# Altium project DA1470x-SmartWatch.PrjPcb
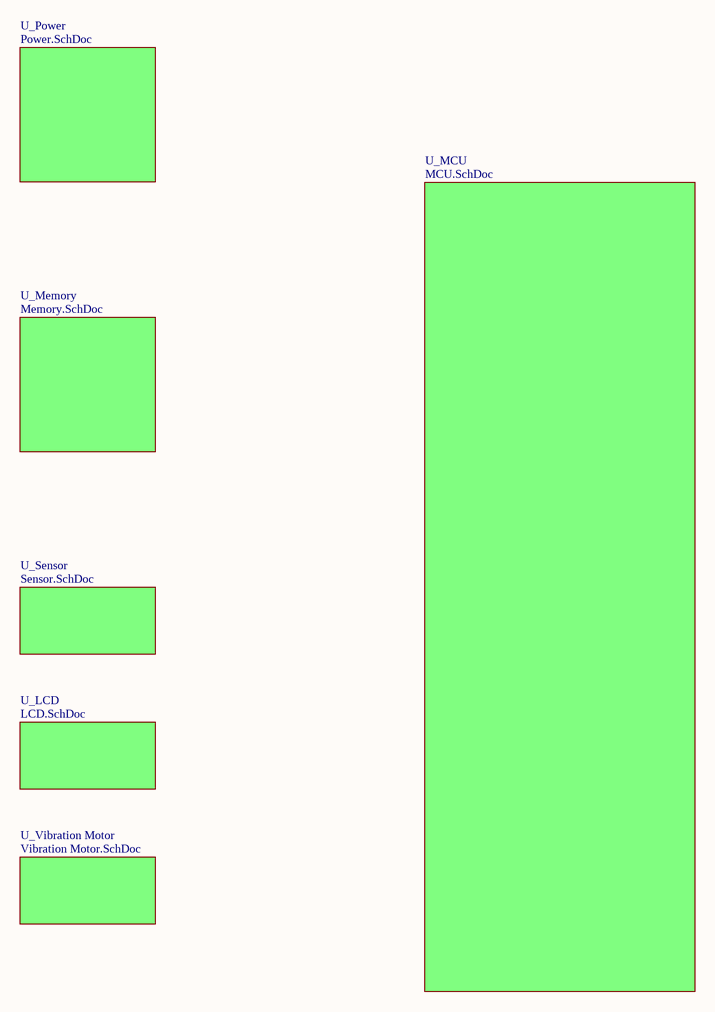
[diagram p0: DA1470x-SmartWatch.SchDoc]
7 sheets, 28 parts. Net scope: flat (ports and power ports of the same name join across sheets).
Sheets:
  DA1470x-SmartWatch.SchDoc
    U_Power = Power.SchDoc
    U_Memory = Memory.SchDoc
    U_MCU = MCU.SchDoc
    U_Sensor = Sensor.SchDoc
    U_LCD = LCD.SchDoc
    U_Vibration Motor = Vibration Motor.SchDoc

## Sheet DA1470x-SmartWatch.SchDoc: DA1470x-SmartWatch
size A3; Organization: Altium Limited; Address1: L3, 12a Rodborough Rd; Address2: Frenchs Forest; Address3: NSW; Address4: Australia 2086; SheetNumber: 1; SheetTotal: 7; SheetSize: A3

### Sub-sheets
U_LCD = LCD.SchDoc: no entries
U_MCU = MCU.SchDoc: no entries
U_Memory = Memory.SchDoc: no entries
U_Power = Power.SchDoc: no entries
U_Sensor = Sensor.SchDoc: no entries
U_Vibration Motor = Vibration Motor.SchDoc: no entries

### Notes on the sheet
- Title:
- Size:
- Project:
- Revision:
- Sheet
- of
- Date:
- YıLDıZ IoT
- Elperek Mahallesi
- Saray Sokak, No:12
- SAKARYA / TURKEY
- File:

## Sheet Power.SchDoc
size A4; ApprovedBy: Muhammet YILDIZ; CheckedBy: Muhammet YILDIZ; Author: Muhammet YILDIZ; CompanyName: YıLDıZ IoT; DrawnBy: Muhammet YILDIZ; Engineer: Muhammet YILDIZ; Organization: YıLDıZ IoT; Address1: Elperek Mahallesi; Address2: Saray Sokak No:12; Address3: SAKARYA / TURKEY; Revision: 1; SheetNumber: 2; SheetTotal: 2; SheetSize: A4

### Notes on the sheet
- Title:
- Size:
- Project:
- Revision:
- Sheet
- of
- Date:
- YıLDıZ IoT
- Elperek Mahallesi
- Saray Sokak, No:12
- SAKARYA / TURKEY
- File:

## Sheet Memory.SchDoc: Memory
size A4; ApprovedBy: Muhammet YILDIZ; CheckedBy: Muhammet YILDIZ; Author: Muhammet YILDIZ; CompanyName: YıLDıZ IoT; DrawnBy: Muhammet YILDIZ; Engineer: Muhammet YILDIZ; Organization: YıLDıZ IoT; Address1: Elperek Mahallesi; Address2: Saray Sokak No:12; Address3: SAKARYA / TURKEY; Revision: 1; SheetNumber: 4; SheetTotal: 4; SheetSize: A4
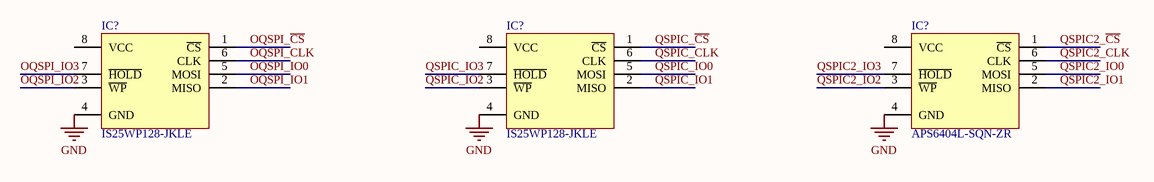
[diagram p1: Memory.SchDoc]

### Parts
(Parts that share a designator on the sheet are numbered #1, #2 ... from top to bottom, then left to right.)
IC?#1  IS25WP128-JKLE  [WINBOND WSON-8 6x5mm]
IC?#2  IS25WP128-JKLE  [WINBOND WSON-8 6x5mm]
IC?#3  APS6404L-SQN-ZR  [WINBOND WSON-8 6x5mm]

### Nets
GND: IC?#1.4(GND) IC?#2.4(GND) IC?#3.4(GND)
OQSPI_~{CS}: IC?#1.1(~{CS})
OQSPI_CLK: IC?#1.6(CLK)
OQSPI_IO0: IC?#1.5(MOSI)
OQSPI_IO1: IC?#1.2(MISO)
OQSPI_IO2: IC?#1.3(~{WP})
OQSPI_IO3: IC?#1.7(~{HOLD})
QSPIC2_~{CS}: IC?#3.1(~{CS})
QSPIC2_CLK: IC?#3.6(CLK)
QSPIC2_IO0: IC?#3.5(MOSI)
QSPIC2_IO1: IC?#3.2(MISO)
QSPIC2_IO2: IC?#3.3(~{WP})
QSPIC2_IO3: IC?#3.7(~{HOLD})
QSPIC_~{CS}: IC?#2.1(~{CS})
QSPIC_CLK: IC?#2.6(CLK)
QSPIC_IO0: IC?#2.5(MOSI)
QSPIC_IO1: IC?#2.2(MISO)
QSPIC_IO2: IC?#2.3(~{WP})
QSPIC_IO3: IC?#2.7(~{HOLD})

Not connected (* = marked no-connect by the designer): IC?#1 8(VCC); IC?#2 8(VCC); IC?#3 8(VCC)

### Notes on the sheet
- Title:
- Size:
- Project:
- Revision:
- Sheet
- of
- Date:
- YıLDıZ IoT
- Elperek Mahallesi
- Saray Sokak, No:12
- SAKARYA / TURKEY
- File:

### Library data of the parts
IC?#1 IC?#2 = WINBOND FLASH SPI 8PIN: NOR Flash Serial (SPI, Dual SPI, Quad SPI) 1.8V 128M-bit 16M x 8 8ns 8-Pin WSON EP; Manufacturer: ISSI; Density: 128Mb; Address Bus Width: 24b; Interface: SPI,Serial; Page Size: 256B; Supplier: Digi-Key; Supplier Part Number: 706-1624-ND; Manufacturer Part Number: IS25WP128-JKLE; RoHS: Yes; Category: Memory; Stock: 1395; Pricing: 1=2.11, 10=1.922, 25=1.8704, 40=1.86075, 80=1.66325, 230=1.65848, 570=1.63344, 1140=1.5641, 5130=1.45623 (USD); Pins: 8; Min Operating Temperature: -40°C; Max Operating Temperature: 105°C; Memory Format: NOR; Operating Supply Voltage: 1.8V; RoHS Compliant: Yes; ComponentLink1URL: http://www.mouser.com/ds/2/198/IS25WP032-064-128-737458.pdf?src-supplier=Mouser; ComponentLink1Description: http://www.mouser.com/ds/2/198/IS25WP032-064-128-737458.pdf?src-supplier=Mouser; ComponentLink2URL: http://www.issi.com/WW/pdf/IS25WP032-064-128.pdf?src-supplier=Avnet; ComponentLink2Description: http://www.issi.com/WW/pdf/IS25WP032-064-128.pdf?src-supplier=Avnet; ComponentLink3URL: http://www.issi.com/WW/pdf/25WP128.pdf?src-supplier=Digi-Key; ComponentLink3Description: http://www.issi.com/WW/pdf/25WP128.pdf?src-supplier=Digi-Key
IC?#3 = WINBOND FLASH SPI 8PIN: NOR Flash Serial (SPI, Dual SPI, Quad SPI) 1.8V 128M-bit 16M x 8 8ns 8-Pin WSON EP; Manufacturer: AP Memory; Supplier: Mouser; Supplier Part Number: 878-APS6404L-SQN-ZR; Manufacturer Part Number: APS6404L-SQN-ZR; RoHS: No; Stock: 4950; Pricing: 1=1.59, 10=1.46, 50=1.46, 100=1.26, 1000=1.19, 10000=0.985 (USD)

## Sheet MCU.SchDoc
size A3; Organization: Altium Limited; Address1: L3, 12a Rodborough Rd; Address2: Frenchs Forest; Address3: NSW; Address4: Australia 2086; SheetNumber: 3; SheetTotal: 7; SheetSize: A3
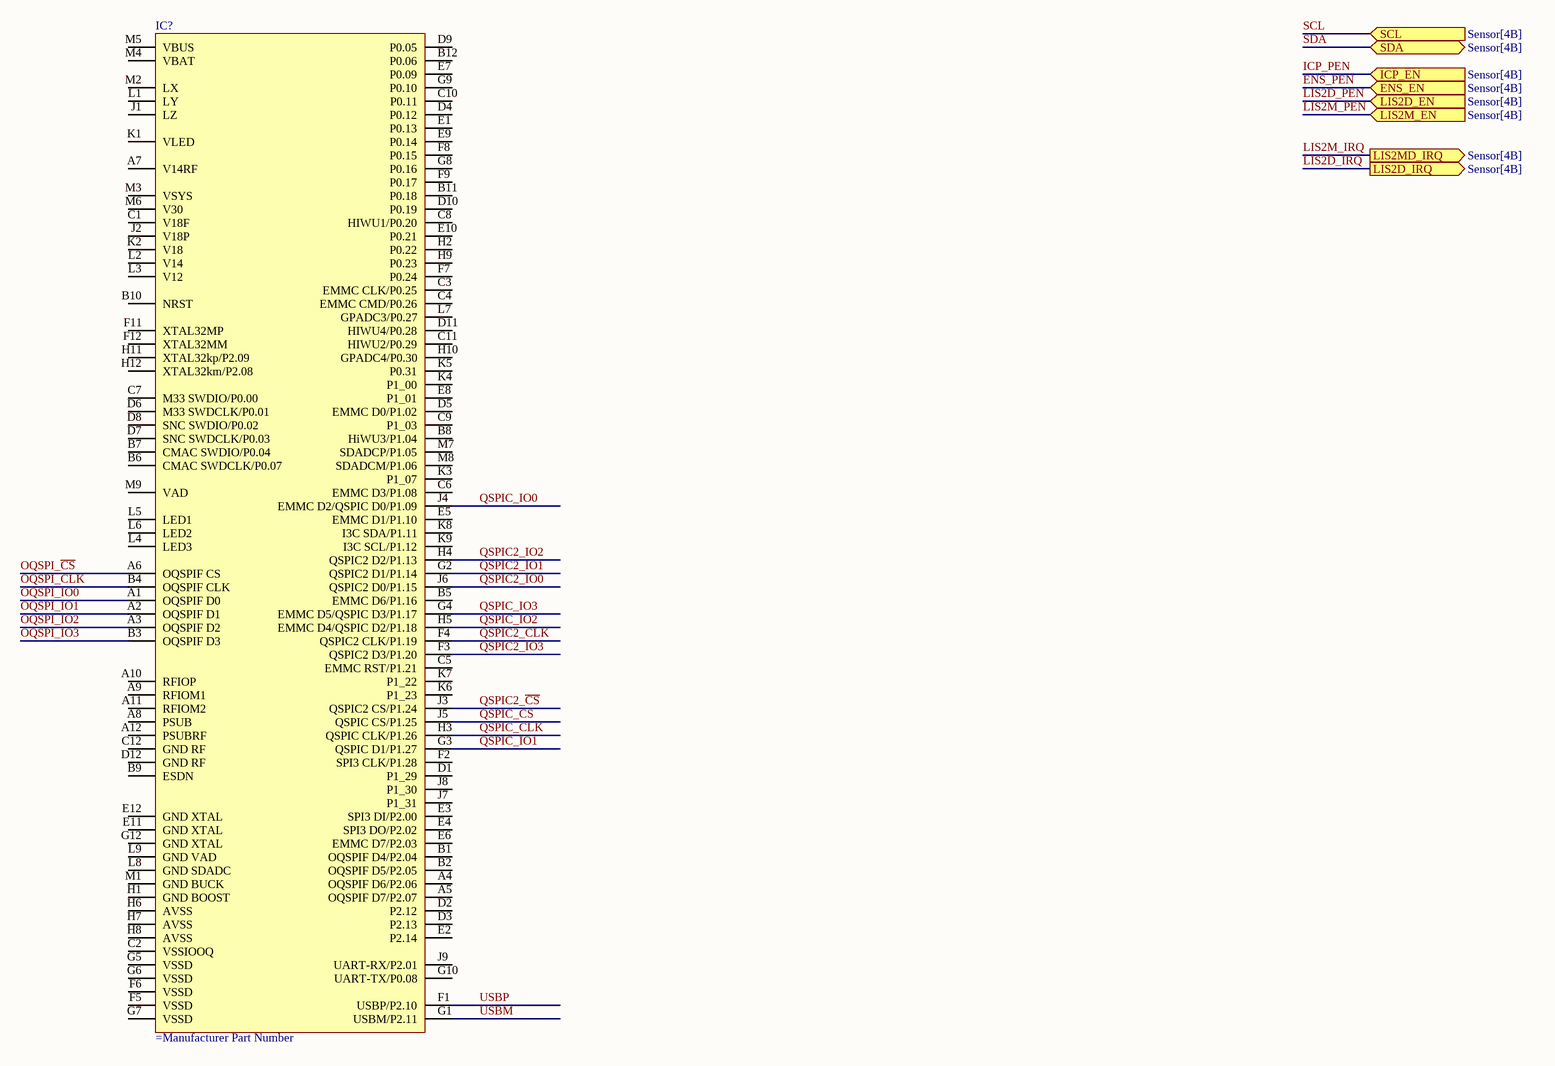
[diagram p2: MCU.SchDoc]

### Parts
(Parts that share a designator on the sheet are numbered #1, #2 ... from top to bottom, then left to right.)
IC?#4  (no value)  [DIALOG VFBGA142]

### Ports
ENS_EN (in, see Sensor[4B]), ICP_EN (in, see Sensor[4B]), LIS2D_EN (in, see Sensor[4B]), LIS2D_IRQ (out, see Sensor[4B]), LIS2M_EN (in, see Sensor[4B]), LIS2MD_IRQ (out, see Sensor[4B]), SCL (in, see Sensor[4B]), SDA (bidir, see Sensor[4B])

### Nets
OQSPI_~{CS}: IC?#4.A6(OQSPIF_CS)
OQSPI_CLK: IC?#4.B4(OQSPIF_CLK)
OQSPI_IO0: IC?#4.A1(OQSPIF_D0)
OQSPI_IO1: IC?#4.A2(OQSPIF_D1)
OQSPI_IO2: IC?#4.A3(OQSPIF_D2)
OQSPI_IO3: IC?#4.B3(OQSPIF_D3)
QSPIC2_~{CS}: IC?#4.J3(QSPIC2_CS/P1.24)
QSPIC2_CLK: IC?#4.F4(QSPIC2_CLK/P1.19)
QSPIC2_IO0: IC?#4.J6(QSPIC2_D0/P1.15)
QSPIC2_IO1: IC?#4.G2(QSPIC2_D1/P1.14)
QSPIC2_IO2: IC?#4.H4(QSPIC2_D2/P1.13)
QSPIC2_IO3: IC?#4.F3(QSPIC2_D3/P1.20)
QSPIC_~{CS}: IC?#4.J5(QSPIC_CS/P1.25)
QSPIC_CLK: IC?#4.H3(QSPIC_CLK/P1.26)
QSPIC_IO0: IC?#4.J4(EMMC_D2/QSPIC_D0/P1.09)
QSPIC_IO1: IC?#4.G3(QSPIC_D1/P1.27)
QSPIC_IO2: IC?#4.H5(EMMC_D4/QSPIC_D2/P1.18)
QSPIC_IO3: IC?#4.G4(EMMC_D5/QSPIC_D3/P1.17)
USBM: IC?#4.G1(USBM/P2.11)
USBP: IC?#4.F1(USBP/P2.10)

Not connected (* = marked no-connect by the designer): IC?#4 A4(OQSPIF_D6/P2.06) A5(OQSPIF_D7/P2.07) A7(V14RF) A8(PSUB) A9(RFIOM1) A10(RFIOP) A11(RFIOM2) A12(PSUBRF) B1(OQSPIF_D4/P2.04) B2(OQSPIF_D5/P2.05) B5(EMMC_D6/P1.16) B6(CMAC_SWDCLK/P0.07) B7(CMAC_SWDIO/P0.04) B8(HiWU3/P1.04) B9(ESDN) B10(NRST) B11(P0.18) B12(P0.06) C1(V18F) C2(VSSIOOQ) C3(EMMC_CLK/P0.25) C4(EMMC_CMD/P0.26) C5(EMMC_RST/P1.21) C6(EMMC_D3/P1.08) C7(M33_SWDIO/P0.00) C8(HIWU1/P0.20) C9(P1_03) C10(P0.11) C11(HIWU2/P0.29) C12(GND_RF) D1(P1_29) D2(P2.12) D3(P2.13) D4(P0.12) D5(EMMC_D0/P1.02) D6(M33_SWDCLK/P0.01) D7(SNC_SWDCLK/P0.03) D8(SNC_SWDIO/P0.02) D9(P0.05) D10(P0.19) D11(HIWU4/P0.28) D12(GND_RF) E1(P0.13) E2(P2.14) E3(SPI3_DI/P2.00) E4(SPI3_DO/P2.02) E5(EMMC_D1/P1.10) E6(EMMC_D7/P2.03) E7(P0.09) E8(P1_01) E9(P0.14) E10(P0.21) E11(GND_XTAL) E12(GND_XTAL) F2(SPI3_CLK/P1.28) F5(VSSD) F6(VSSD) F7(P0.24) F8(P0.15) F9(P0.17) F11(XTAL32MP) F12(XTAL32MM) G5(VSSD) G6(VSSD) G7(VSSD) G8(P0.16) G9(P0.10) G10(UART-TX/P0.08) G12(GND_XTAL) H1(GND_BOOST) H2(P0.22) H6(AVSS) H7(AVSS) H8(AVSS) H9(P0.23) H10(GPADC4/P0.30) H11(XTAL32kp/P2.09) H12(XTAL32km/P2.08) J1(LZ) J2(V18P) J7(P1_31) J8(P1_30) J9(UART-RX/P2.01) K1(VLED) K2(V18) K3(P1_07) K4(P1_00) K5(P0.31) K6(P1_23) K7(P1_22) K8(I3C_SDA/P1.11) K9(I3C_SCL/P1.12) L1(LY) L2(V14) L3(V12) L4(LED3) L5(LED1) L6(LED2) L7(GPADC3/P0.27) L8(GND_SDADC) L9(GND_VAD) M1(GND_BUCK) M2(LX) M3(VSYS) M4(VBAT) M5(VBUS) M6(V30) M7(SDADCP/P1.05) M8(SDADCM/P1.06) M9(VAD)

### Notes on the sheet
- Title:
- Size:
- Project:
- Revision:
- Sheet
- of
- Date:
- YıLDıZ IoT
- Elperek Mahallesi
- Saray Sokak, No:12
- SAKARYA / TURKEY
- File:

### Library data of the parts
IC?#4 = DIALOG DA14706: DA14706 builds off the successes of Renesas SmartBond line, with Arm Cortex-M33F at 160 MHz as integrated application processors, 2D graphics processor, Voice Activity Detector (VAD) and Power Management Unit (PMU). With its ultra-low-power radio transceiver offering +6 dBm output power, and -97 dBm sensitivity combined with its software-configurable and upgradeable protocol engine (MAC), the DA14706 is capable of supporting Bluetooth low energy as well as multiple other 2.4GHz protocols. These unique f

## Sheet Sensor.SchDoc: Sensor
size A4; ApprovedBy: Muhammet YILDIZ; CheckedBy: Muhammet YILDIZ; Author: Muhammet YILDIZ; CompanyName: YıLDıZ IoT; DrawnBy: Muhammet YILDIZ; Engineer: Muhammet YILDIZ; Organization: YıLDıZ IoT; Address1: Elperek Mahallesi; Address2: Saray Sokak No:12; Address3: SAKARYA / TURKEY; Revision: 1; SheetNumber: 6; SheetTotal: 7; SheetSize: A4
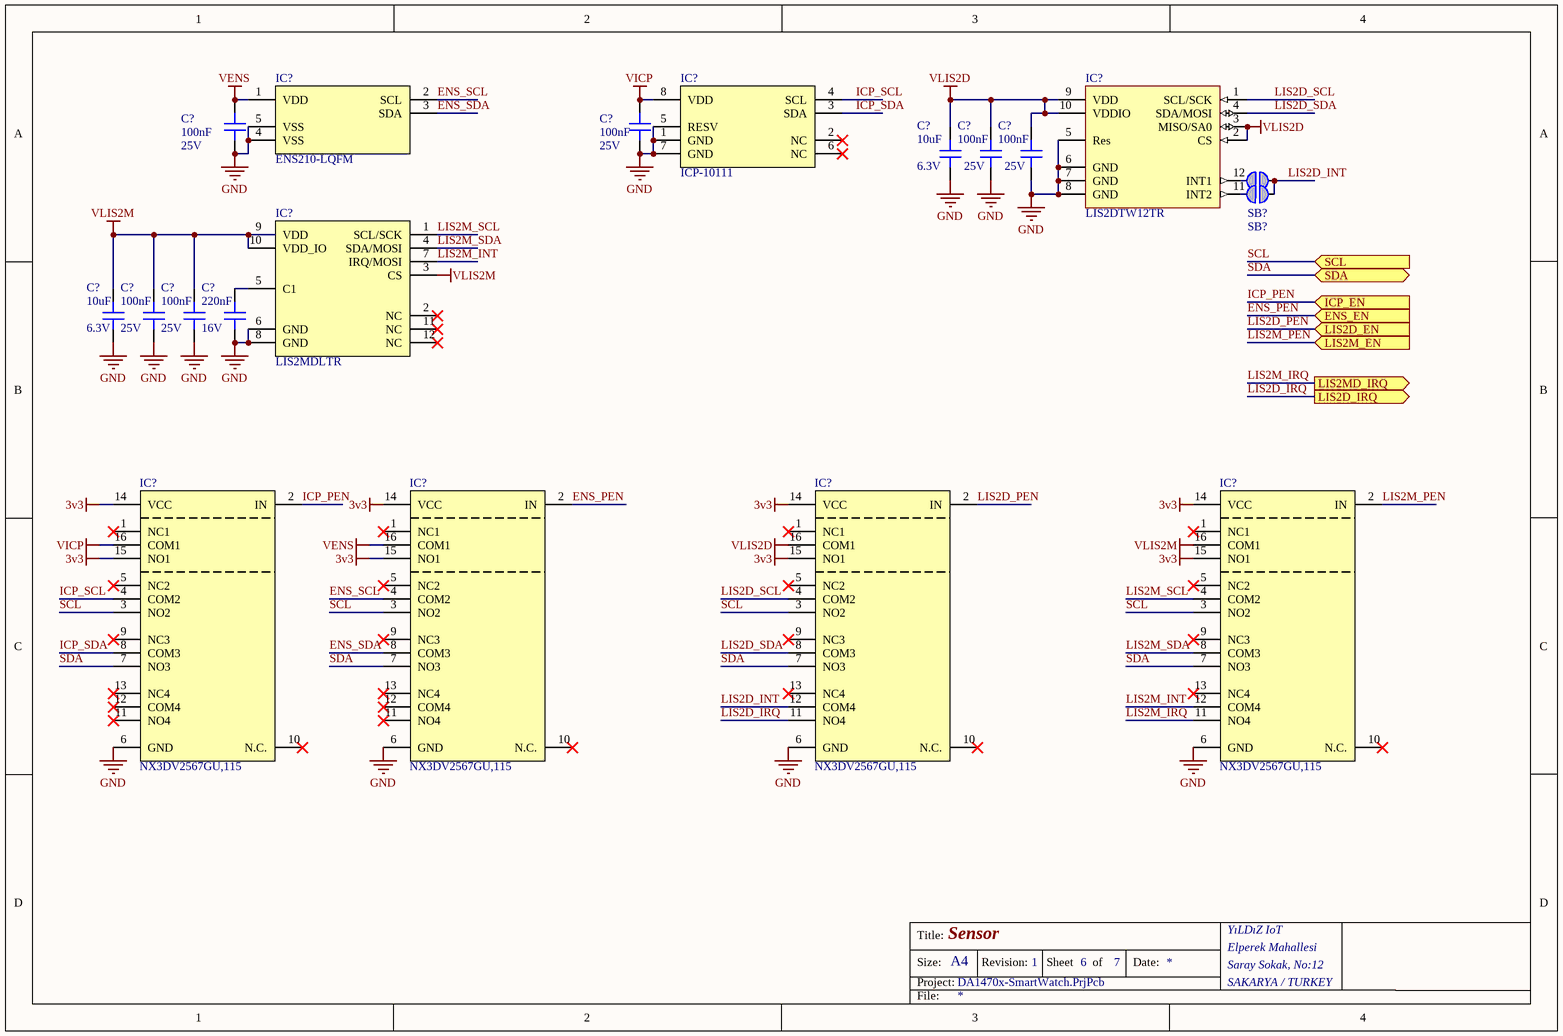
[diagram p3: Sensor.SchDoc]

### Parts
(Parts that share a designator on the sheet are numbered #1, #2 ... from top to bottom, then left to right.)
C?#1  100nF  Voltage Rating (DC): 25V  [CAP 0402/1005]
C?#2  100nF  Voltage Rating (DC): 25V  [CAP 0402/1005]
C?#3  10uF  Voltage Rating: 6.3V  [CAP 0402/1005]
C?#4  100nF  Voltage Rating (DC): 25V  [CAP 0402/1005]
C?#5  100nF  Voltage Rating (DC): 25V  [CAP 0402/1005]
C?#6  10uF  Voltage Rating: 6.3V  [CAP 0402/1005]
C?#7  100nF  Voltage Rating (DC): 25V  [CAP 0402/1005]
C?#8  100nF  Voltage Rating (DC): 25V  [CAP 0402/1005]
C?#9  220nF  Voltage Rating: 16V  [CAP 0402/1005]
IC?#5  ENS210-LQFM  [SCIONSENSE ENS210LQFM]
IC?#6  ICP-10111  [TDK ICP10111]
IC?#7  LIS2DTW12TR  [ST LGA-12 2x2x0.7]
IC?#8  LIS2MDLTR  [ST LGA-12 2x2x0.7]
IC?#9  NX3DV2567GU,115  [NXP XQFN16]
IC?#10  NX3DV2567GU,115  [NXP XQFN16]
IC?#11  NX3DV2567GU,115  [NXP XQFN16]
IC?#12  NX3DV2567GU,115  [NXP XQFN16]
SB?#1  (no value)  [Solderbridge-Circular]  (no BOM)
SB?#2  (no value)  [Solderbridge-Circular]  (no BOM)

### Ports
ENS_EN (in), ICP_EN (in), LIS2D_EN (in), LIS2D_IRQ (out), LIS2M_EN (in), LIS2MD_IRQ (out), SCL (in), SDA (bidir)

### Nets
3v3: IC?#9.14(VCC) IC?#9.15(NO1) IC?#10.14(VCC) IC?#10.15(NO1) IC?#11.14(VCC) IC?#11.15(NO1) IC?#12.14(VCC) IC?#12.15(NO1)
GND: C?#1.1 C?#2.1 C?#3.1 C?#4.1 C?#5.1 C?#6.1 C?#7.1 C?#8.1 C?#9.1 IC?#5.4(VSS) IC?#5.5(VSS) IC?#6.1(GND) IC?#6.5(RESV) IC?#6.7(GND) IC?#7.5(Res) IC?#7.6(GND) IC?#7.7(GND) IC?#7.8(GND) IC?#8.6(GND) IC?#8.8(GND) IC?#9.6(GND) IC?#10.6(GND) IC?#11.6(GND) IC?#12.6(GND)
VENS: C?#1.2 IC?#5.1(VDD) IC?#10.16(COM1)
VICP: C?#2.2 IC?#6.8(VDD) IC?#9.16(COM1)
VLIS2D: C?#3.2 C?#4.2 C?#5.2 IC?#7.2(CS) IC?#7.3(MISO/SA0) IC?#7.9(VDD) IC?#7.10(VDDIO) IC?#11.16(COM1)
VLIS2M: C?#6.2 C?#7.2 C?#8.2 IC?#8.3(CS) IC?#8.9(VDD) IC?#8.10(VDD_IO) IC?#12.16(COM1)
ENS_PEN: IC?#10.2(IN) ; port ENS_EN
ENS_SCL: IC?#5.2(SCL) IC?#10.4(COM2)
ENS_SDA: IC?#5.3(SDA) IC?#10.8(COM3)
ICP_PEN: IC?#9.2(IN) ; port ICP_EN
ICP_SCL: IC?#6.4(SCL) IC?#9.4(COM2)
ICP_SDA: IC?#6.3(SDA) IC?#9.8(COM3)
LIS2D_INT: IC?#11.12(COM4) SB?#1.2 SB?#2.2
LIS2D_IRQ: IC?#11.11(NO4) ; port LIS2D_IRQ
LIS2D_PEN: IC?#11.2(IN) ; port LIS2D_EN
LIS2D_SCL: IC?#7.1(SCL/SCK) IC?#11.4(COM2)
LIS2D_SDA: IC?#7.4(SDA/MOSI) IC?#11.8(COM3)
LIS2M_INT: IC?#8.7(IRQ/MOSI) IC?#12.12(COM4)
LIS2M_IRQ: IC?#12.11(NO4) ; port LIS2MD_IRQ
LIS2M_PEN: IC?#12.2(IN) ; port LIS2M_EN
LIS2M_SCL: IC?#8.1(SCL/SCK) IC?#12.4(COM2)
LIS2M_SDA: IC?#8.4(SDA/MOSI) IC?#12.8(COM3)
SCL: IC?#9.3(NO2) IC?#10.3(NO2) IC?#11.3(NO2) IC?#12.3(NO2) ; port SCL
SDA: IC?#9.7(NO3) IC?#10.7(NO3) IC?#11.7(NO3) IC?#12.7(NO3) ; port SDA
NetC?#9_2: C?#9.2 IC?#8.5(C1)
NetIC?#7_11: IC?#7.11(INT2) SB?#2.1
NetIC?#7_12: IC?#7.12(INT1) SB?#1.1

Not connected (* = marked no-connect by the designer): IC?#6 2(NC)* 6(NC)*; IC?#8 2(NC)* 11(NC)* 12(NC)*; IC?#9 1(NC1)* 5(NC2)* 9(NC3)* 10(N.C.)* 11(NO4)* 12(COM4)* 13(NC4)*; IC?#10 1(NC1)* 5(NC2)* 9(NC3)* 10(N.C.)* 11(NO4)* 12(COM4)* 13(NC4)*; IC?#11 1(NC1)* 5(NC2)* 9(NC3)* 10(N.C.)* 13(NC4)*; IC?#12 1(NC1)* 5(NC2)* 9(NC3)* 10(N.C.)* 13(NC4)*

### Notes on the sheet
- Title:
- Size:
- Project:
- Revision:
- Sheet
- of
- Date:
- YıLDıZ IoT
- Elperek Mahallesi
- Saray Sokak, No:12
- SAKARYA / TURKEY
- File:

### Library data of the parts
C?#1 C?#2 C?#4 C?#5 C?#7 C?#8 = Capacitor - Ceramic: Cap Ceramic 0.1uF 25V X5R 10% Pad SMD 0402 85¡ãC T/R / Multi Layer Ceramic Capacitor (MLCC); Manufacturer: Samsung; Manufacturer Part Number: CL05A104KA5NNNC; Supplier 1: Digi-Key; Supplier Part Number 1: 1276-1043-6-ND; RoHS: Yes; Category: Ceramic Capacitors; Pricing 1: 1=0,10000, 10=0,01100, 50=0,00600, 100=0,00490, 500=0,00346, 1000=0,00272, 2500=0,00248, 5000=0,00228 (USD); Mount: Surface Mount; Case/Package: 0402; Case Code (Imperial): 0402; Case Code (Metric): 1005; Min Operating Temperature: -55°C; Max Operating Temperature: 85°C; Capacitance: 100nF; Packaging: Tape and Reel; Tolerance: 10%; Package Quantity: 1; Voltage Rating: 25V; Dielectric: X5R; Voltage: 25V; Length: 1mm; Width: 0.02inch; Height: 0.5mm; Thickness: 0.022inch; Depth: 0.5mm; Radiation Hardening: No; Lead Free: Lead Free; ComponentLink1URL: https://datasheet.ciiva.com/25802/cl05a104ka5nnnc-25802704.pdf?src-supplier=Digi-Key; ComponentLink1Description: https://datasheet.ciiva.com/25802/cl05a104ka5nnnc-25802704.pdf?src-supplier=Digi-Key; ComponentLink2URL: https://datasheet.ciiva.com/16437/cl05a104ka5nnnc-16437369.pdf?src-supplier=Future+Electronics; ComponentLink2Description: https://datasheet.ciiva.com/16437/cl05a104ka5nnnc-16437369.pdf?src-supplier=Future+Electronics; ComponentLink3URL: https://datasheet.ciiva.com/26838/getdatasheetpartid-357412-26838142.pdf?src-supplier=Verical; ComponentLink3Description: https://datasheet.ciiva.com/26838/getdatasheetpartid-357412-26838142.pdf?src-supplier=Verical; ComponentLink4URL: https://datasheet.ciiva.com/26309/mlcc-catalogdownload2013-eng-26309014.pdf?src-supplier=Distrelec; ComponentLink4Description: https://datasheet.ciiva.com/26309/mlcc-catalogdownload2013-eng-26309014.pdf?src-supplier=Distrelec
C?#3 C?#6 = Capacitor - Ceramic: 0402 10 uF 6.3 V ±20 % Tolerance X5R Surface Mount Multilayer Ceramic Capacitor; Manufacturer: Murata; Manufacturer Part Number: GRM155R60J106ME15D; Tolerance: 20%; Supplier 1: Digi-Key; Supplier Part Number 1: 490-13238-1-ND; RoHS: Yes; Category: Ceramic Capacitors; Pricing 1: 1=0,18000, 10=0,12400, 50=0,07440, 100=0,06280, 500=0,04296, 1000=0,03800, 2500=0,03635, 5000=0,03304 (USD); Mount: Surface Mount; Case/Package: 0402; Case Code (Metric): 1005; Case Code (Imperial): 0402; Min Operating Temperature: -55°C; Max Operating Temperature: 85°C; Packaging: Tape and Reel; Capacitance: 10uF; Voltage Rating (DC): 6.3V; Dielectric: X5R; Length: 0.039inch; Width: 0.02inch; Thickness: 0.026inch; RoHS Compliant: Yes; ComponentLink1URL: https://www.murata.com/~/media/webrenewal/support/library/catalog/products/capacitor/mlcc/c02e.ashx?la=en-us&src-supplier=Digi-Key; ComponentLink1Description: https://www.murata.com/~/media/webrenewal/support/library/catalog/products/capacitor/mlcc/c02e.ashx?la=en-us&src-supplier=Digi-Key
C?#9 = Capacitor - Ceramic: Ceramic capacitor SMD-0402 220nF /16V X7R# K +-10%, Samsung, RoHS; Manufacturer Part Number: CL05B224KO5NNNC; Tolerance: 10%; Dielectric: X7R; Supplier 1: Digi-Key; Supplier Part Number 1: 1276-1176-1-ND; Manufacturer: Samsung; RoHS: Yes; Category: Ceramic Capacitors; Pricing 1: 1=0,10000, 10=0,03300, 50=0,01780, 100=0,01460, 500=0,01040, 1000=0,00817, 2500=0,00742, 5000=0,00683 (USD); Mount: Surface Mount; Case/Package: 0402; Case Code (Metric): 1005; Case Code (Imperial): 0402; Min Operating Temperature: -55°C; Max Operating Temperature: 125°C; Packaging: Tape and Reel; Capacitance: 220nF; Package Quantity: 1; Series: CL; Construction: Flat; Length: 1mm; Width: 0.02inch; Height: 0.5mm; Thickness: 0.022inch; Depth: 0.5mm; Radiation Hardening: No; RoHS Compliant: Yes; ComponentLink1URL: https://datasheet.ciiva.com/25800/cl05b224ko5nnnc-25800450.pdf?src-supplier=Digi-Key; ComponentLink1Description: https://datasheet.ciiva.com/25800/cl05b224ko5nnnc-25800450.pdf?src-supplier=Digi-Key; ComponentLink2URL: https://datasheet.ciiva.com/26838/getdatasheetpartid-358459-26838228.pdf?src-supplier=Verical; ComponentLink2Description: https://datasheet.ciiva.com/26838/getdatasheetpartid-358459-26838228.pdf?src-supplier=Verical; ComponentLink3URL: https://datasheet.ciiva.com/16428/cl05b224ko5nnnc-16428810.pdf?src-supplier=Future+Electronics; ComponentLink3Description: https://datasheet.ciiva.com/16428/cl05b224ko5nnnc-16428810.pdf?src-supplier=Future+Electronics
IC?#5 = SCIOSENSE ENS210-LQFM: ENS210 Series 3.6V 100%RH Relative Humidity & Temperature Sensor w/I²C Interface; Supplier 1: Digi-Key; Supplier Part Number 1: 2618-ENS210-LQFMCT-ND; Manufacturer: ScioSense; Manufacturer Part Number: ENS210-LQFM; Stock 1: 47662; Pricing 1: 1=2,87000, 5=2,66400, 10=2,21400, 25=1,84480, 50=1,64000, 100=1,55800, 500=1,31200, 1000=1,23000 (USD); ComponentLink1URL: https://datasheet.octopart.com/ENS210-LQFM-ScioSense-datasheet-149899868.pdf?src-supplier=Future+Electronics; ComponentLink1Description: https://datasheet.octopart.com/ENS210-LQFM-ScioSense-datasheet-149899868.pdf?src-supplier=Future+Electronics
IC?#6 = TDK ICP-10111: Barometric Pressure/Temperature Sensor Digital 30kPa to 110kPa/-20 to 65°C 8-Pin LGA T/R; Manufacturer: TDK InvenSense; Output Type: I2C; Pressure Type: Differential; Operating Pressure: 15.95PSI; Port Style: No Port; Supplier 1: Digi-Key; Supplier Part Number 1: 1428-1145-1-ND; Manufacturer Part Number: ICP-10111; RoHS: No; Category: Pressure Sensors; Stock 1: 11029; Pricing 1: 1=4,26000, 5=3,76200, 10=3,32300, 25=2,69600, 50=2,38260, 100=2,31990, 500=1,94370, 1000=1,81830, 5000=1,69290 (USD); Case/Package: LGA; Number of Pins: 8; Min Operating Temperature: -40°C; Max Operating Temperature: 85°C; Termination: SMD/SMT; RoHS Compliant: No; ComponentLink1URL: https://product.tdk.com/info/en/documents/catalog_datasheet/capacitive-pressure/DS-000186-ICP-101xx-v1.1.pdf?src-supplier=Digi-Key; ComponentLink1Description: https://product.tdk.com/info/en/documents/catalog_datasheet/capacitive-pressure/DS-000186-ICP-101xx-v1.1.pdf?src-supplier=Digi-Key; ComponentLink2URL: https://product.tdk.com/info/en/documents/catalog_datasheet/capacitive-pressure/DS-000186-ICP-101xx-v1.0.pdf?src-supplier=Digi-Key; ComponentLink2Description: https://product.tdk.com/info/en/documents/catalog_datasheet/capacitive-pressure/DS-000186-ICP-101xx-v1.0.pdf?src-supplier=Digi-Key
IC?#7 = ST LIS2DE12TR: 3-axis MEMS Accelerometer and Temperature Sensor Digital Output 1.8V 12-Pin LGA T/R; Manufacturer: STMicroelectronics; Supplier 1: Digi-Key; Supplier Part Number 1: 497-19047-1-ND; Manufacturer Part Number: LIS2DTW12TR; RoHS: Yes; Category: Accelerometers; Stock 1: 8556; Pricing 1: 1=3,37000, 10=3,02400, 25=2,85880, 100=2,47750, 500=2,11750 (USD)
IC?#8 = ST LIS2MDLTR: LIS2MDL Series 3.6V 50 Hz High Performance 3-Axis Digital Magnetic Sensor-LGA-12; Manufacturer: STMicroelectronics; Output Type: SPI,I2C; Sensing Method: Magnetoresistive; Axis: X, Y, Z; Resolution: 16b; Bandwidth: 50Hz; Supplier 1: Digi-Key; Supplier Part Number 1: 497-17588-1-ND; Manufacturer Part Number: LIS2MDLTR; RoHS: Yes; Category: Inertial Measurement Units (IMUs); Stock 1: 4476; Pricing 1: 1=3,07000, 10=2,75500, 25=2,59880, 100=2,21410, 500=1,81912, 1000=1,73250 (USD); Case/Package: LGA; Number of Pins: 12; Min Operating Temperature: -40°C; Max Operating Temperature: 85°C; Packaging: Tape and Reel; RoHS Compliant: Yes; ComponentLink1URL: http://www.farnell.com/datasheets/2815952.pdf?src-supplier=Farnell; ComponentLink1Description: http://www.farnell.com/datasheets/2815952.pdf?src-supplier=Farnell; ComponentLink2URL: http://www.farnell.com/datasheets/2815952.pdf?src-supplier=Newark; ComponentLink2Description: http://www.farnell.com/datasheets/2815952.pdf?src-supplier=Newark; ComponentLink3URL: http://www.st.com/content/ccc/resource/technical/document/datasheet/group3/29/13/d1/e0/9a/4d/4f/30/DM00395193/files/DM00395193.pdf/jcr:content/translations/en.DM00395193.pdf?src-supplier=Digi-Key; ComponentLink3Description: http://www.st.com/content/ccc/resource/technical/document/datasheet/group3/29/13/d1/e0/9a/4d/4f/30/DM00395193/files/DM00395193.pdf/jcr:content/translations/en.DM00395193.pdf?src-supplier=Digi-Key
IC?#9-IC?#12 = NXP NX3DV2567GU,115: NX3DV2567 Series 4.3 V 10.5 Ohm 4PDT Low-Ohmic Analog Switch - XQFN-16; Manufacturer: NXP Semiconductors; Number of Inputs: 4; Number of Outputs: 2; Number of Channels: 1; Min Supply Voltage: 1.4V; Max Supply Voltage: 4.3V; Max Power Dissipation: 250mW; On-State Resistance: 700mR; Operating Supply Current: 150nA; Turn-On Delay Time: 50ns; Turn-Off Delay Time: 30ns; Supply Type: Single; Supplier 1: Digi-Key; Supplier Part Number 1: 568-5206-1-ND; Manufacturer Part Number: NX3DV2567GU,115; RoHS: Yes; Category: Interface ICs; Stock 1: 5231; Pricing 1: 1=0,98000, 10=0,87300, 25=0,82880, 100=0,80340 (USD); Mount: Surface Mount; Number of Pins: 16; Min Operating Temperature: -40°C; Max Operating Temperature: 125°C; Package Quantity: 1; Packaging: Tape and Reel; Max Supply Current: 150nA; Power Dissipation: 250mW; Series: -; Radiation Hardening: No; Lead Free: Lead Free; RoHS Compliant: Yes; ComponentLink1URL: https://datasheet.ciiva.com/1667/nx3dv2567-1667296.pdf?src-supplier=Digi-Key; ComponentLink1Description: https://datasheet.ciiva.com/1667/nx3dv2567-1667296.pdf?src-supplier=Digi-Key; ComponentLink2URL: https://datasheet.ciiva.com/4917/nx3dv2567-42536-4917579.pdf?src-supplier=Mouser; ComponentLink2Description: https://datasheet.ciiva.com/4917/nx3dv2567-42536-4917579.pdf?src-supplier=Mouser; ComponentLink3URL: https://datasheet.ciiva.com/1667/nx3dv2567-1667295.pdf?src-supplier=Digi-Key; ComponentLink3Description: https://datasheet.ciiva.com/1667/nx3dv2567-1667295.pdf?src-supplier=Digi-Key; ComponentLink4URL: https://datasheet.ciiva.com/1667/nx3dv2567-1667294.pdf?src-supplier=Digi-Key; ComponentLink4Description: https://datasheet.ciiva.com/1667/nx3dv2567-1667294.pdf?src-supplier=Digi-Key; ComponentLink5URL: https://datasheet.ciiva.com/6638/nx3dv2567-6638700.pdf?src-supplier=Digi-Key; ComponentLink5Description: https://datasheet.ciiva.com/6638/nx3dv2567-6638700.pdf?src-supplier=Digi-Key
SB?#1 SB?#2 = SOLDERBRIDGE

## Sheet LCD.SchDoc: LCD
size A4; ApprovedBy: Muhammet YILDIZ; CheckedBy: Muhammet YILDIZ; Author: Muhammet YILDIZ; CompanyName: YıLDıZ IoT; DrawnBy: Muhammet YILDIZ; Engineer: Muhammet YILDIZ; Organization: YıLDıZ IoT; Address1: Elperek Mahallesi; Address2: Saray Sokak No:12; Address3: SAKARYA / TURKEY; Revision: 1; SheetNumber: 5; SheetTotal: 5; SheetSize: A4
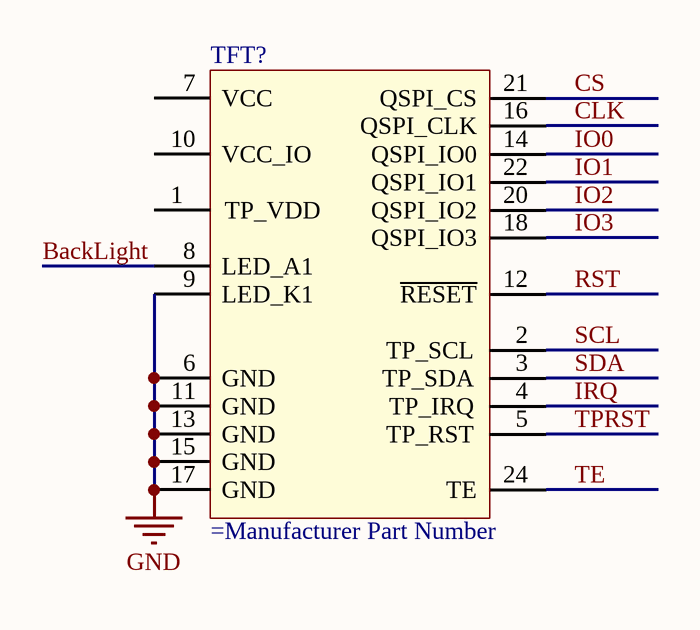
[diagram p4: LCD.SchDoc]

### Parts
TFT?  (no value)  [EASTRISE ER-TFT1.32-1]

### Nets
GND: TFT?.6(GND) TFT?.9(LED_K1) TFT?.11(GND) TFT?.13(GND) TFT?.15(GND) TFT?.17(GND)
BackLight: TFT?.8(LED_A1)
CLK: TFT?.16(QSPI_CLK)
CS: TFT?.21(QSPI_CS)
IO0: TFT?.14(QSPI_IO0)
IO1: TFT?.22(QSPI_IO1)
IO2: TFT?.20(QSPI_IO2)
IO3: TFT?.18(QSPI_IO3)
IRQ: TFT?.4(TP_IRQ)
RST: TFT?.12(~{RESET})
SCL: TFT?.2(TP_SCL)
SDA: TFT?.3(TP_SDA)
TE: TFT?.24(TE)
TPRST: TFT?.5(TP_RST)

Not connected (* = marked no-connect by the designer): TFT? 1(TP_VDD) 7(VCC) 10(VCC_IO)

### Notes on the sheet
- Title:
- Size:
- Project:
- Revision:
- Sheet
- of
- Date:
- YıLDıZ IoT
- Elperek Mahallesi
- Saray Sokak, No:12
- SAKARYA / TURKEY
- File:

### Library data of the parts
TFT? = EASTRISE ER-TFT1.32-1: ER-TFT1.32-1 TFT LCD Display Datasheet

## Sheet Vibration Motor.SchDoc: Vibration Motor
size A4; ApprovedBy: Muhammet YILDIZ; CheckedBy: Muhammet YILDIZ; Author: Muhammet YILDIZ; CompanyName: YıLDıZ IoT; DrawnBy: Muhammet YILDIZ; Engineer: Muhammet YILDIZ; Organization: YıLDıZ IoT; Address1: Elperek Mahallesi; Address2: Saray Sokak No:12; Address3: SAKARYA / TURKEY; Revision: 1; SheetNumber: 7; SheetTotal: 7; SheetSize: A4
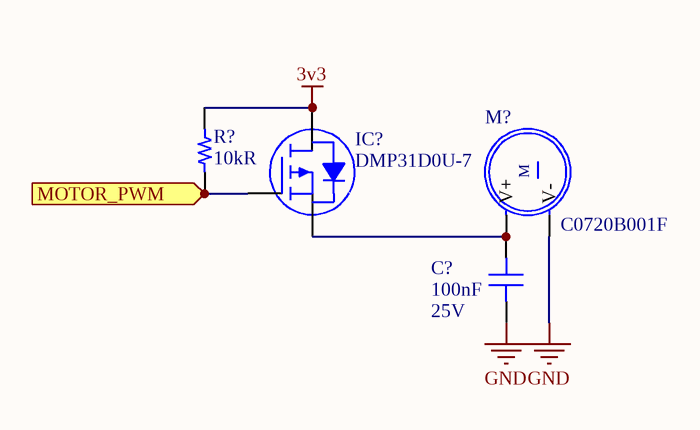
[diagram p5: Vibration Motor.SchDoc]

### Parts
(Parts that share a designator on the sheet are numbered #1, #2 ... from top to bottom, then left to right.)
C?#10  100nF  Voltage Rating (DC): 25V  [CAP 0402/1005]
IC?#13  DMP31D0U-7  [DIODES SOT-23-3]
M?  C0720B001F  [VYBRONICS C0720B001F]
R?  10kR  [RES 0402/1005]

### Ports
MOTOR_PWM (in)

### Nets
3v3: IC?#13.3(D) R?.2
GND: C?#10.1 M?.2(V-)
NetC?#10_2: C?#10.2 IC?#13.2(S) M?.1(V+)
NetIC?#13_1: IC?#13.1(G) R?.1 ; port MOTOR_PWM

### Notes on the sheet
- Title:
- Size:
- Project:
- Revision:
- Sheet
- of
- Date:
- YıLDıZ IoT
- Elperek Mahallesi
- Saray Sokak, No:12
- SAKARYA / TURKEY
- File:
- (in symbol VYBRONICS C0720B001F) M

### Library data of the parts
C?#10 = Capacitor - Ceramic: as C?#1 on sheet Sensor; Supplier 1: Digi-Key; Supplier Part Number 1: 1276-1043-6-ND; RoHS: Yes; Category: Ceramic Capacitors; Pricing 1: 1=0,10000, 10=0,01100, 50=0,00600, 100=0,00490, 500=0,00346, 1000=0,00272, 2500=0,00248, 5000=0,00228 (USD); Mount: Surface Mount; Case/Package: 0402; Case Code (Imperial): 0402; Case Code (Metric): 1005; Min Operating Temperature: -55°C; Max Operating Temperature: 85°C; Capacitance: 100nF; Packaging: Tape and Reel; Tolerance: 10%; Package Quantity: 1; Voltage Rating: 25V; Dielectric: X5R; Voltage: 25V; Length: 1mm; Width: 0.02inch; Height: 0.5mm; Thickness: 0.022inch; Depth: 0.5mm; Radiation Hardening: No; Lead Free: Lead Free; ComponentLink1URL: https://datasheet.ciiva.com/25802/cl05a104ka5nnnc-25802704.pdf?src-supplier=Digi-Key; ComponentLink1Description: https://datasheet.ciiva.com/25802/cl05a104ka5nnnc-25802704.pdf?src-supplier=Digi-Key; ComponentLink2URL: https://datasheet.ciiva.com/16437/cl05a104ka5nnnc-16437369.pdf?src-supplier=Future+Electronics; ComponentLink2Description: https://datasheet.ciiva.com/16437/cl05a104ka5nnnc-16437369.pdf?src-supplier=Future+Electronics; ComponentLink3URL: https://datasheet.ciiva.com/26838/getdatasheetpartid-357412-26838142.pdf?src-supplier=Verical; ComponentLink3Description: https://datasheet.ciiva.com/26838/getdatasheetpartid-357412-26838142.pdf?src-supplier=Verical; ComponentLink4URL: https://datasheet.ciiva.com/26309/mlcc-catalogdownload2013-eng-26309014.pdf?src-supplier=Distrelec; ComponentLink4Description: https://datasheet.ciiva.com/26309/mlcc-catalogdownload2013-eng-26309014.pdf?src-supplier=Distrelec
IC?#13 = DMP31D0U-7: MOSFET P-CH 30V 530MA SOT23; Manufacturer: Diodes Incorporated; Current - Continuous Drain (Id) @ 25°C: 530mA (Ta); Drive Voltage (Max Rds On,  Min Rds On): 1.8V, 4.5V; FET Type: P-Channel; Gate Charge (Qg) (Max) @ Vgs: 0.9nC @ 4.5V; Input Capacitance (Ciss) (Max) @ Vds: 76pF @ 15V; Power Dissipation (Max): 450mW (Ta); Rds On (Max) @ Id, Vgs: 1Ohm @ 400mA, 4.5V; Vgs (Max): ±8V; Vgs(th) (Max) @ Id: 1.1V @ 250µA; Part Number: DMP31D0U-7; ComponentLink1Description: Datasheet; ComponentLink1URL: https://www.diodes.com/assets/Datasheets/DMP31D0U.pdf; ComponentLink2Description: DigiKey Link; ComponentLink2URL: http://digikey.com/product-detail/en/diodes-incorporated/DMP31D0U-7/DMP31D0U-7DICT-ND/4457888; Drain to Source Voltage (Vdss): 30V; LastUpdated: 02.09.2020 01:25:04; Lifecycle Status: Active; Minimum Order: 1; Mounting Type: Surface Mount; Operating Temperature: -55°C ~ 150°C (TJ); Package / Case: TO-236-3, SC-59, SOT-23-3; Packaging: TapeAndReel; Part Status: Active; Price: 0.09; Series: -; Supplier 1: DigiKey; Supplier Part Number 1: DMP31D0U-7DICT-ND; Supplier Device Package: SOT-23; Technology: MOSFET (Metal Oxide)
M? = VYBRONICS C0720B001F: DC Motor Vibration, ERM 10000 RPM 3VDC; Supplier Part Number 1: 1670-VC0720B001F-ND; Manufacturer Part Number: C0720B001F
R? = Resistor_Chip: Res Thick Film 0402 10K Ohm 1% 0.063W(1/16W) ±100ppm/C Pad SMD Automotive T/R; Manufacturer: Stackpole Electronics; Manufacturer Part Number: RMCF0402FT10K0; Power Rating: 62.5mW; Temperature Coefficient: 100ppm/°C; Max Power Dissipation: 63mW; Supplier 1: Digi-Key; Supplier Part Number 1: RMCF0402FT10K0DKR-ND; RoHS: Yes; Category: Chip SMD Resistors; Pricing 1: 1=0,10000, 10=0,01500, 100=0,00610, 1000=0,00274, 2500=0,00238, 5000=0,00197 (USD); Mount: Surface Mount; Case/Package: 0402; Case Code (Metric): 1005; Case Code (Imperial): 0402; Contact Plating: Tin,Matte; Size Code: 0402; Min Operating Temperature: -55°C; Max Operating Temperature: 155°C; Tolerance: 1%; Packaging: Tape and Reel; Resistance: 10kR; Resistor Type: Thick Film; Number of Terminations: 2; Features: Automotive AEC-Q200; Series: RMCF; Construction: Rectangular; Length: 1mm; Width: 0.02inch; Height: 0.016inch; Depth: 0.5mm; Radiation Hardening: No; Military Standard: Not; Lead Free: Lead Free; RoHS Compliant: Yes; ComponentLink1URL: https://datasheet.ciiva.com/24341/sei-rmcp-24341800.pdf?src-supplier=Onlinecomponents.com; ComponentLink1Description: https://datasheet.ciiva.com/24341/sei-rmcp-24341800.pdf?src-supplier=Onlinecomponents.com

## Nets that join several sheets
3v3: Sensor (8 pins), Vibration Motor (IC?#13.3 R?.2)
GND: Memory (IC?#1.4 IC?#2.4 IC?#3.4), Sensor (24 pins), LCD (6 pins), Vibration Motor (C?#10.1 M?.2)